# Altium schematic sheet LTM8032_5V5.SchDoc
size A3; DocumentNumber: 8; SheetNumber: 8; SheetTotal: 10
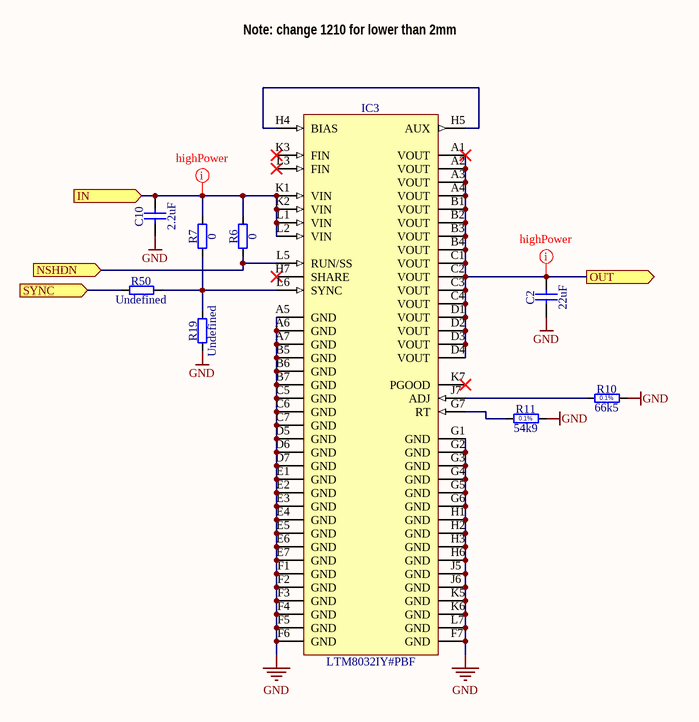
[diagram p0: LTM8032_5V5.SchDoc]

## Parts
C2  22uF  [CAPC3216X180N]
C10  2.2uF  [CAPC2012X140N]
IC3  LTM8032IY#PBF  [BGA71C127P7X11_900X1500X362]
R6  0  [RESC1608X55N]
R7  0  [RESC1608X55N]
R10  66k5  [RESC1608X55N]
R11  54k9  [RESC1608X55N]
R19  Undefined  [RESC1608X55N]
R50  Undefined  [RESC1608X55N]

## Ports
IN (in), NSHDN (in), OUT (out), SYNC (in)

## Nets
GND: C2.1 C10.1 IC3.A5(GND) IC3.A6(GND) IC3.A7(GND) IC3.B5(GND) IC3.B6(GND) IC3.B7(GND) IC3.C5(GND) IC3.C6(GND) IC3.C7(GND) IC3.D5(GND) IC3.D6(GND) IC3.D7(GND) IC3.E1(GND) IC3.E2(GND) IC3.E3(GND) IC3.E4(GND) IC3.E5(GND) IC3.E6(GND) IC3.E7(GND) IC3.F1(GND) IC3.F2(GND) IC3.F3(GND) IC3.F4(GND) IC3.F5(GND) IC3.F6(GND) IC3.F7(GND) IC3.G1(GND) IC3.G2(GND) IC3.G3(GND) IC3.G4(GND) IC3.G5(GND) IC3.G6(GND) IC3.H1(GND) IC3.H2(GND) IC3.H3(GND) IC3.H6(GND) IC3.J5(GND) IC3.J6(GND) IC3.K5(GND) IC3.K6(GND) IC3.L7(GND) R10.2 R11.2 R19.1
IN: C10.2 IC3.K1(VIN) IC3.K2(VIN) IC3.L1(VIN) IC3.L2(VIN) R6.2 R7.2 ; port IN
NSHDN: IC3.L5(RUN/SS) R6.1 ; port NSHDN
OUT: C2.2 IC3.A1(VOUT) IC3.A2(VOUT) IC3.A3(VOUT) IC3.A4(VOUT) IC3.B1(VOUT) IC3.B2(VOUT) IC3.B3(VOUT) IC3.B4(VOUT) IC3.C1(VOUT) IC3.C2(VOUT) IC3.C3(VOUT) IC3.C4(VOUT) IC3.D1(VOUT) IC3.D2(VOUT) IC3.D3(VOUT) IC3.D4(VOUT) ; port OUT
SYNC: R50.1 ; port SYNC
NetIC3_G7: IC3.G7(RT) R11.1
NetIC3_H4: IC3.H4(BIAS) IC3.H5(AUX)
NetIC3_J7: IC3.J7(ADJ) R10.1
NetIC3_L6: IC3.L6(SYNC) R7.1 R19.2 R50.2

Not connected (* = marked no-connect by the designer): IC3 H7(SHARE)* K3(FIN)* K7(PGOOD)* L3(FIN)*

## Layout directives
net class highPower: IN, OUT

## Notes on the sheet
- Note: change 1210 for lower than 2mm
- (in symbol R0603_54K9_0.1%_0.063W_10PPM) 0.1%
- (in symbol R0603_66K5_0.1%_0.063W_10PPM) 0.1%

## Library data of the parts
C2 = CC1206_22UF_10V_10%_X7R: Non-polarised capacitor; Part Description: SMD Multilayer Chip Ceramic Capacitor; Manufacturer: GENERIC; Manufacturer1 Part Number: GRM31CR71A226KE15L; Voltage: 10V; TC: X7R; Tolerance: ±10%; Part Number: CC1206_22UF_10V_10%_X7R; Component Kind: Standard; Component Type: Standard; Pin Count: 2; Value: 22uF; Status: Preferred; Manufacturer Part Number: CC1206_22UF_10V_10%_X7R; Case: 1206; Mounted: Yes; Socket: No; SMD: Yes; Sense: No; Manufacturer1 Example: MURATA; Manufacturer1 ComponentHeight: 1.8mm; HelpURL: \\cern.ch\dfs\Applications\Altium\Datasheets\CC1206_X7R_MURATA_GRM-HI-CAP.pdf; Author: CERN DEM JLC; CreateDate: 08.06.2010; LatestRevisionDate: 08.06.2010
C10 = CC0805_2.2UF_50V_10%_X7R: Non-polarised capacitor; Part Description: SMD Multilayer Chip Ceramic Capacitor; Manufacturer: GENERIC; Manufacturer1 Part Number: GRM21BR61H225KA73L; Voltage: 50V; TC: X7R; Tolerance: ±10%; Part Number: CC0805_2.2UF_50V_10%_X7R; Component Kind: Standard; Component Type: Standard; Pin Count: 2; Value: 2.2uF; Status: Preferred; Manufacturer Part Number: CC0805_2.2UF_50V_10%_X7R; Case: 0805; Mounted: Yes; Socket: No; SMD: Yes; Sense: No; Manufacturer1 Example: MURATA; Manufacturer1 ComponentHeight: 1.40mm; HelpURL: \\cern.ch\dfs\Applications\Altium\Datasheets\CC0805_X7R_MURATA_GRM.pdf; Author: CERN DEM JLC; CreateDate: 18.08.2014; LatestRevisionDate: 18.08.2014
IC3 = LTM8032IY#PBF: 3V-36V To 0.8V-10V, Iout 2A Ultralow Noise EMC Compliant DC/DC uModule; Part Description: 3V-36V To 0.8V-10V, Iout 2A, Ultralow Noise EMC Compliant DC-DC uModule; Manufacturer: LINEAR TECHNOLOGY; PressFit: No; Bonding: No; Part Number: LTM8032IY#PBF; Component Kind: Standard; Component Type: Standard; Device: LTM8032IY#PBF; PackageDescription: BGA, 1.27mm pitch, rect., 71 pin, 7 columns X 11 rows, 9mm X 15mm X 3.62mm H; Manufacturer Part Number: LTM8032IY#PBF; Pin Count: 71; Case: BGA71; Mounted: Yes; Socket: No; SMD: Yes; Sense: No; ComponentHeight: 3.62mm; HelpURL: \\cern.ch\dfs\Applications\Altium\Datasheets\LTM8032IY#PBF.pdf; Author: CERN DEM BC; CreateDate: 17.12.2018; LatestRevisionDate: 17.12.2018
R6 R7 = R0603_0R_JUMPER: Resistor; Part Description: 1A (0.05R Max DC Resistance) Zero Ohm Jumper; Manufacturer: GENERIC; Manufacturer1 Part Number: NRC06Z0; PressFit: No; Part Number: R0603_0R_JUMPER; Component Kind: Standard; Component Type: Standard; Pin Count: 2; Value: 0; Status: Preferred; Manufacturer Part Number: R0603_0R_JUMPER; Case: 0603; Mounted: Yes; Sense: No; Socket: No; SMD: Yes; Manufacturer1 Example: NIC COMPONENT; Manufacturer1 ComponentHeight: 0.55mm; HelpURL: \\cern.ch\dfs\Applications\Altium\Datasheets\R0603_NIC_NRC.pdf; Author: CERN DEM JLC; CreateDate: 03.12.2007; LatestRevisionDate: 13.03.2008
R10 = R0603_66K5_0.1%_0.063W_10PPM: Resistor - 0.1%; Part Description: Thin Film Chip Resistor; Manufacturer: GENERIC; Manufacturer1 Part Number: RN73C1J66K5BTDF; Power: 0.063W; TC: ±10ppm; PressFit: No; Part Number: R0603_66K5_0.1%_0.063W_10PPM; Component Kind: Standard; Component Type: Standard; Pin Count: 2; Value: 66k5; Status: Not Recommended; Tolerance: ±0.1%; Manufacturer Part Number: R0603_66K5_0.1%_0.063W_10PPM; Case: 0603; Mounted: Yes; Sense: No; Socket: No; SMD: Yes; Manufacturer1 Example: TYCO HOLSWORTHY; Manufacturer1 ComponentHeight: 0.5mm; HelpURL: \\cern.ch\dfs\Applications\Altium\Datasheets\R0603_Tyco_RN73.pdf; Author: CERN DEM JLC; CreateDate: 03.12.2007; LatestRevisionDate: 13.03.2008
R11 = R0603_54K9_0.1%_0.063W_10PPM: Resistor - 0.1%; Part Description: Thin Film Chip Resistor; Manufacturer: GENERIC; Manufacturer1 Part Number: RN73C1J54K9BTDF; Power: 0.063W; TC: ±10ppm; PressFit: No; Part Number: R0603_54K9_0.1%_0.063W_10PPM; Component Kind: Standard; Component Type: Standard; Pin Count: 2; Value: 54k9; Status: Not Recommended; Tolerance: ±0.1%; Manufacturer Part Number: R0603_54K9_0.1%_0.063W_10PPM; Case: 0603; Mounted: Yes; Sense: No; Socket: No; SMD: Yes; Manufacturer1 Example: TYCO HOLSWORTHY; Manufacturer1 ComponentHeight: 0.5mm; HelpURL: \\cern.ch\dfs\Applications\Altium\Datasheets\R0603_Tyco_RN73.pdf; Author: CERN DEM JLC; CreateDate: 03.12.2007; LatestRevisionDate: 13.03.2008
R19 R50 = R0603_NO-VALUE: Resistor; Part Description: Reserved Footprint For a 0603 (1608) Chip Resistor; PressFit: No; Mounted: No; Part Number: R0603_NO-VALUE; Component Kind: Standard; Component Type: Standard; Pin Count: 2; Value: Undefined; Status: None; Manufacturer: Undefined; Manufacturer Part Number: R0603_NO-VALUE; Case: 0603; Sense: No; Socket: No; SMD: Yes; Manufacturer1 Example: Undefined; Manufacturer1 Part Number: Undefined; Manufacturer1 ComponentHeight: Undefined; HelpURL: Undefined; Author: CERN DEM JLC; CreateDate: 03.12.2007; LatestRevisionDate: 13.03.2008